# EAGLE design motherboard (EAGLE 7.6.0)
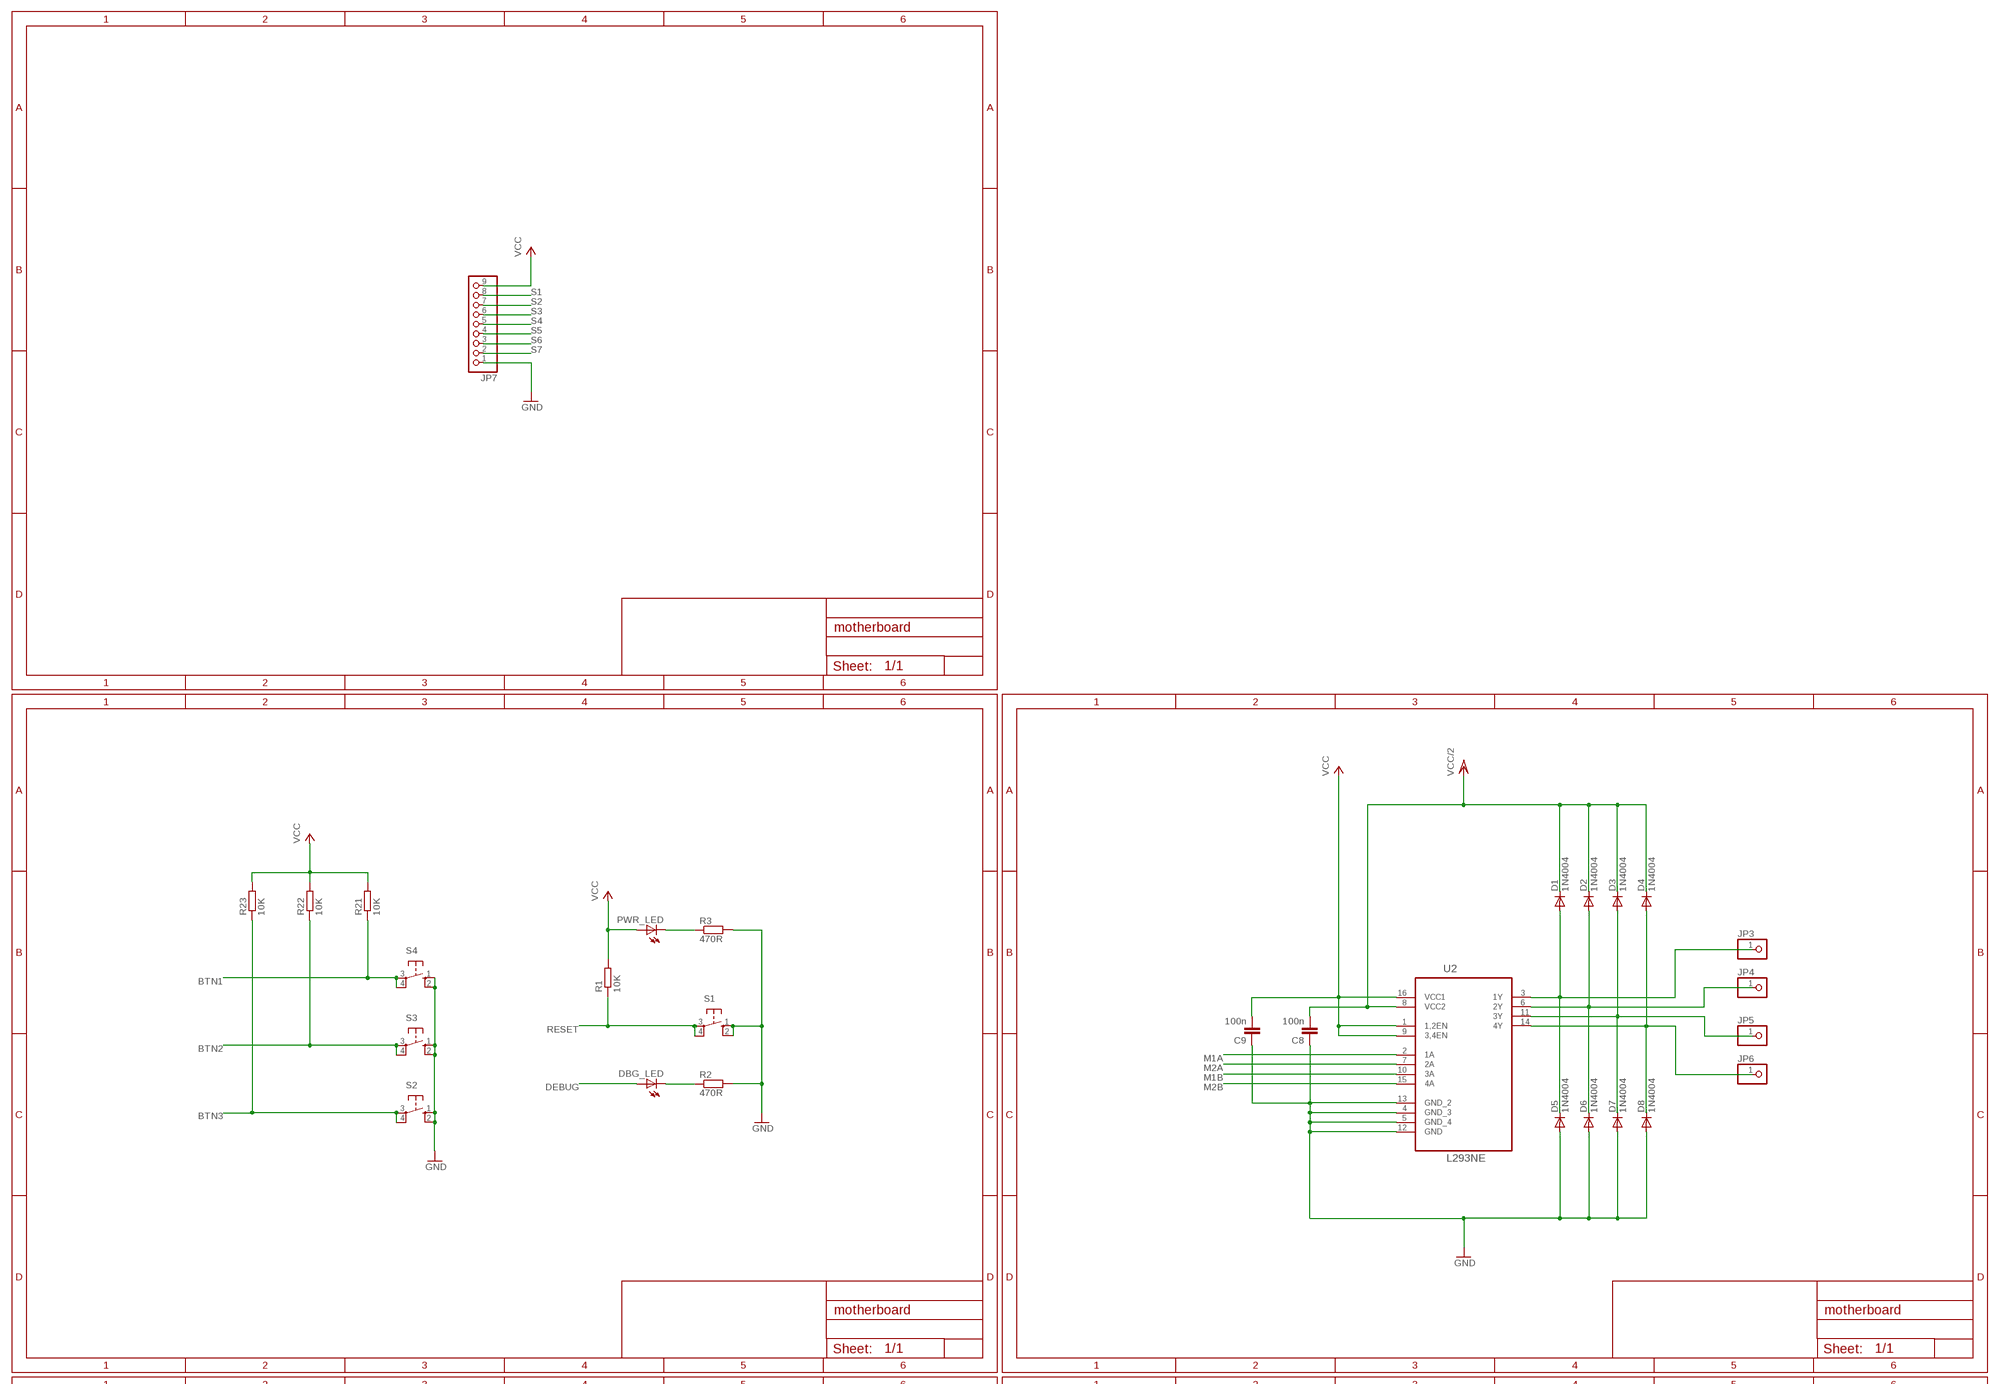
[diagram p0: schematic, sheet 1, part 1 of 2]
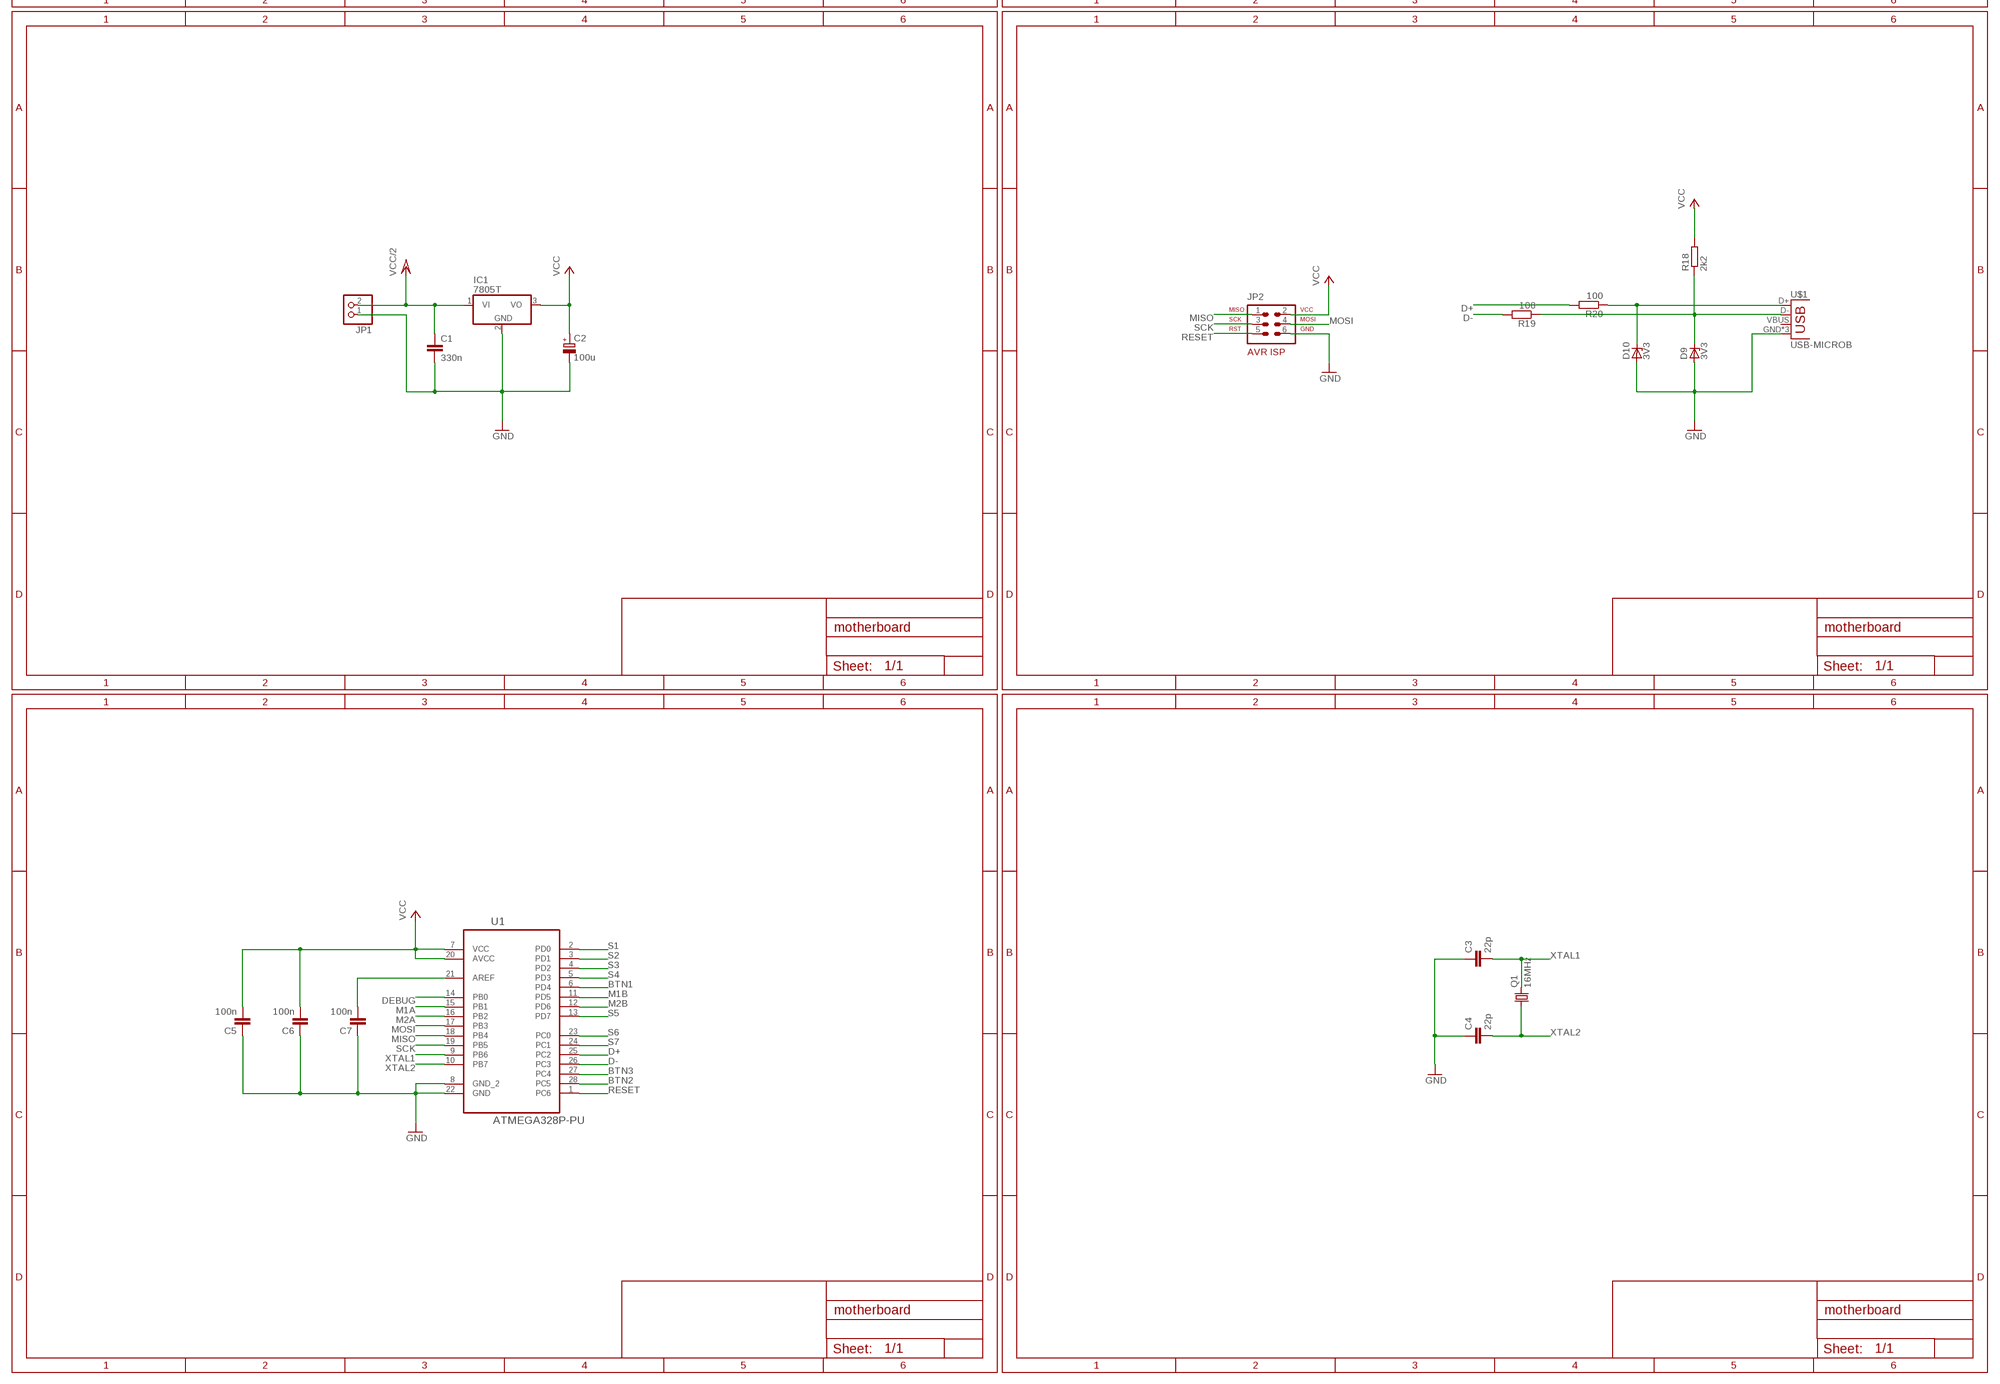
[diagram p1: schematic, sheet 1, part 2 of 2]

## Parts
C1  330n  C-EUC0805K  [C0805K]
C2  100u  CPOL-EUE2.5-5  [E2,5-5]
C3  22p  C-EUC0805K  [C0805K]
C4  22p  C-EUC0805K  [C0805K]
C5  100n  C-EUC0805K  [C0805K]
C6  100n  C-EUC0805K  [C0805K]
C7  100n  C-EUC0805K  [C0805K]
C8  100n  C-EUC0805K  [C0805K]
C9  100n  C-EUC0805K  [C0805K]
D1  1N4004  [DO41-10]
D2  1N4004  [DO41-10]
D3  1N4004  [DO41-10]
D4  1N4004  [DO41-10]
D5  1N4004  [DO41-10]
D6  1N4004  [DO41-10]
D7  1N4004  [DO41-10]
D8  1N4004  [DO41-10]
D9  3V3  ZENER-DIODEDO41Z10  [DO41Z10]
D10  3V3  ZENER-DIODEDO41Z10  [DO41Z10]
DBG_LED  LED5MM  [LED5MM]
IC1  7805T  [TO220H]
JP1  PINHD-1X2  [1X02]
JP2  AVR-ISP-6VERT  [AVR-ISP-6]
JP3  PINHD-1X1  [1X01]
JP4  PINHD-1X1  [1X01]
JP5  PINHD-1X1  [1X01]
JP6  PINHD-1X1  [1X01]
JP7  PINHD-1X9  [1X09]
PWR_LED  LED5MM  [LED5MM]
Q1  16MHz  CRYSTALHC49S  [HC49/S]
R1  10K  R-EU_M0805  [M0805]
R2  470R  R-EU_M0805  [M0805]
R3  470R  R-EU_M0805  [M0805]
R18  2k2  R-EU_M0805  [M0805]
R19  100  R-EU_M0805  [M0805]
R20  100  R-EU_M0805  [M0805]
R21  10K  R-EU_M0805  [M0805]
R22  10K  R-EU_M0805  [M0805]
R23  10K  R-EU_M0805  [M0805]
S1  10-XX  [B3F-10XX]
S2  10-XX  [B3F-10XX]
S3  10-XX  [B3F-10XX]
S4  10-XX  [B3F-10XX]
U1  ATMEGA328P-PU  [DIP254P762X457-28]
U2  L293NE  [DIP254P762X508-16]
U$1  USB-MICROB  [USB-MICROB]

## Nets
BTN1: R21.1 S4.3(P) S4.4(P1) U1.6(PD4)
BTN2: R22.1 S3.3(P) S3.4(P1) U1.28(PC5)
BTN3: R23.1 S2.3(P) S2.4(P1) U1.27(PC4)
D+: R20.2 U1.25(PC2)
D-: R19.2 U1.26(PC3)
DEBUG: DBG_LED.A U1.14(PB0)
GND: C1.2 C2.- C3.1 C4.1 C5.1 C6.1 C7.1 C8.1 C9.1 D5.A D6.A D7.A D8.A D9.A D10.A IC1.2(GND) JP1.1 JP2.6 JP7.1 R2.2 R3.2 S1.1(S) S1.2(S1) S2.1(S) S2.2(S1) S3.1(S) S3.2(S1) S4.1(S) S4.2(S1) U1.8(GND_2) U1.22(GND) U2.4(GND_3) U2.5(GND_4) U2.12(GND) U2.13(GND_2) U$1.GND U$1.MT1(GND) U$1.MT2(GND)
M1A: U1.15(PB1) U2.2(1A)
M1B: U1.11(PD5) U2.10(3A)
M2A: U1.16(PB2) U2.7(2A)
M2B: U1.12(PD6) U2.15(4A)
MISO: JP2.1 U1.18(PB4)
MOSI: JP2.4 U1.17(PB3)
N$1: PWR_LED.K(C) R3.1
N$2: DBG_LED.K(C) R2.1
N$3: C7.2 U1.21(AREF)
N$4: D1.A D5.C JP3.1 U2.3(1Y)
N$5: D2.A D6.C JP4.1 U2.6(2Y)
N$6: D3.A D7.C JP5.1 U2.11(3Y)
N$7: D4.A D8.C JP6.1 U2.14(4Y)
N$16: D9.C R18.1 R19.1 U$1.D-
N$19: D10.C R20.1 U$1.D+
RESET: JP2.5 R1.1 S1.3(P) S1.4(P1) U1.1(PC6)
S1: JP7.8 U1.2(PD0)
S2: JP7.7 U1.3(PD1)
S3: JP7.6 U1.4(PD2)
S4: JP7.5 U1.5(PD3)
S5: JP7.4 U1.13(PD7)
S6: JP7.3 U1.23(PC0)
S7: JP7.2 U1.24(PC1)
SCK: JP2.3 U1.19(PB5)
VCC: C2.+ C5.2 C6.2 C9.2 IC1.3(VO) JP2.2 JP7.9 PWR_LED.A R1.2 R18.2 R21.2 R22.2 R23.2 U1.7(VCC) U1.20(AVCC) U2.1(1,2EN) U2.9(3,4EN) U2.16(VCC1)
VCC/2: C1.1 C8.2 D1.C D2.C D3.C D4.C IC1.1(VI) JP1.2 U2.8(VCC2)
XTAL1: C3.2 Q1.2 U1.9(PB6)
XTAL2: C4.2 Q1.1 U1.10(PB7)
Unconnected: U$1.VBUS

## Library data of the parts
C1 C3-C9 = resistor:C-EU: CAPACITOR, European symbol
C2 = resistor:CPOL-EU: POLARIZED CAPACITOR, European symbol
D1-D8 = diode:1N4004: DIODE general purpose rectifier, 1 A
D9 D10 = diode:ZENER-DIODE: Z-Diode
DBG_LED PWR_LED = led:LED: LED OSRAM: - CHIPLED LG R971, LG N971, LY N971, LG Q971, LY Q971, LO R971, LY R971 LH N974, LH R974 LS Q976, LO Q976, LY Q976 LO Q996 - Hyper CHIPLED LW Q18S LB Q993, LB Q99A, LB R99A - SideLED LS A670, LO A670, LY A670, LG A670, LP A670 LB A673, LV A673, LT A673, LW A673 LH A674 LY A675 LS A676, LA A676, LO A676, LY A676, LW A676 LS A679, LY A679, LG A679 - Hyper Micro SIDELED® LS Y876, LA Y876, LO Y876, LY Y876 LT Y87S - SmartLED LW L88C, LW L88S LB L89C, LB L89S, LG L890 LS L89K, LO L89K, LY L89K LS L896, LA L896, LO L896, LY L896 - TOPLED LS T670, LO T670, LY T670, LG T670, LP T670 LSG T670, LSP T670, LSY T670, LOP T670, LYG T670 LG T671, LOG T671, LSG T671 LB T673, LV T673, LT T673, LW T673 LH T674 LS T676, LA T676, LO T676, LY T676, LB T676, LH T676, LSB T676, LW T676 LB T67C, LV T67C, LT T67C, LS T67K, LO T67K, LY T67K, LW E67C LS E67B, LA E67B, LO E67B, LY E67B, LB E67C, LV E67C, LT E67C LW T67C LS T679, LY T679, LG T679 LS T770, LO T770, LY T770, LG T770, LP T770 LB T773, LV T773, LT T773, LW T773 LH T774 LS E675, LA E675, LY E675, LS T675 LS T776, LA T776, LO T776, LY T776, LB T776 LHGB T686 LT T68C, LB T68C - Hyper Mini TOPLED® LB M676 - Mini TOPLED Santana® LG M470 LS M47K, LO M47K, LY M47K Source: http://www.osram.convergy.de LUXEON: - LUMILED® LXK2-PW12-R00, LXK2-PW12-S00, LXK2-PW14-U00, LXK2-PW14-V00 LXK2-PM12-R00, LXK2-PM12-S00, LXK2-PM14-U00 LXK2-PE12-Q00, LXK2-PE12-R00, LXK2-PE12-S00, LXK2-PE14-T00, LXK2-PE14-U00 LXK2-PB12-K00, LXK2-PB12-L00, LXK2-PB12-M00, LXK2-PB14-N00, LXK2-PB14-P00, LXK2-PB14-Q00 LXK2-PR12-L00, LXK2-PR12-M00, LXK2-PR14-Q00, LXK2-PR14-R00 LXK2-PD12-Q00, LXK2-PD12-R00, LXK2-PD12-S00 LXK2-PH12-R00, LXK2-PH12-S00 LXK2-PL12-P00, LXK2-PL12-Q00, LXK2-PL12-R00 Source: www.luxeon.com KINGBRIGHT: KA-3528ASYC Source: www.kingbright.com
IC1 = linear:78*: Positive VOLTAGE REGULATOR Source: http://cache.national.com/ds/LM/LM78L05.pdf http://www.fairchildsemi.com/ds/LM/LM7805.pdf
JP1 = pinhead:PINHD-1X2: PIN HEADER
JP2 = avr-7:AVR-ISP-6: AVR ISP-6 Serial Programming Header
JP3-JP6 = pinhead:PINHD-1X1: PIN HEADER
JP7 = pinhead:PINHD-1X9: PIN HEADER
Q1 = crystal:CRYSTAL: CRYSTAL; OC_FARNELL: 1667008; OC_NEWARK: unknown
R1-R3 R18-R23 = resistor:R-EU_: RESISTOR, European symbol
S1-S4 = switch-omron:10-XX: OMRON SWITCH; MPN: B3F-1000; OC_FARNELL: 176432; OC_NEWARK: 36M3542
U1 = untitled:ATMEGA328P-PU: 8-bit Microcontroller with In-System Programmable Flash; MPN: ATMEGA328P-PU; OC_FARNELL: 1715487; OC_NEWARK: 15R0268; PACKAGE: PDIP-28; SUPPLIER: Atmel
U2 = untitled:L293NE: QUADRUPLE HALF-H DRIVERS; MPN: L293NE; OC_FARNELL: -; OC_NEWARK: 06F9524; PACKAGE: PDIP-16; SUPPLIER: Texas Instruments
U$1 = SparkFun-Connectors:USB: USB Connectors USB-B-PTH is fully proven SKU : PRT-00139/CONN-08278 USB-miniB is fully proven SKU : PRT-00587 USB-A-PCB is untested. USB-A-H is throughly reviewed, but untested. Spark Fun Electronics SKU : PRT-00437 USB-B-SMT is throughly reviewed, but untested. Needs silkscreen touching up. USB-A-S has not been used/tested USB-MB-H has not been used/tested USB-MICROB has been used. CONN-09505; PROD_ID: CONN-09505

## Board
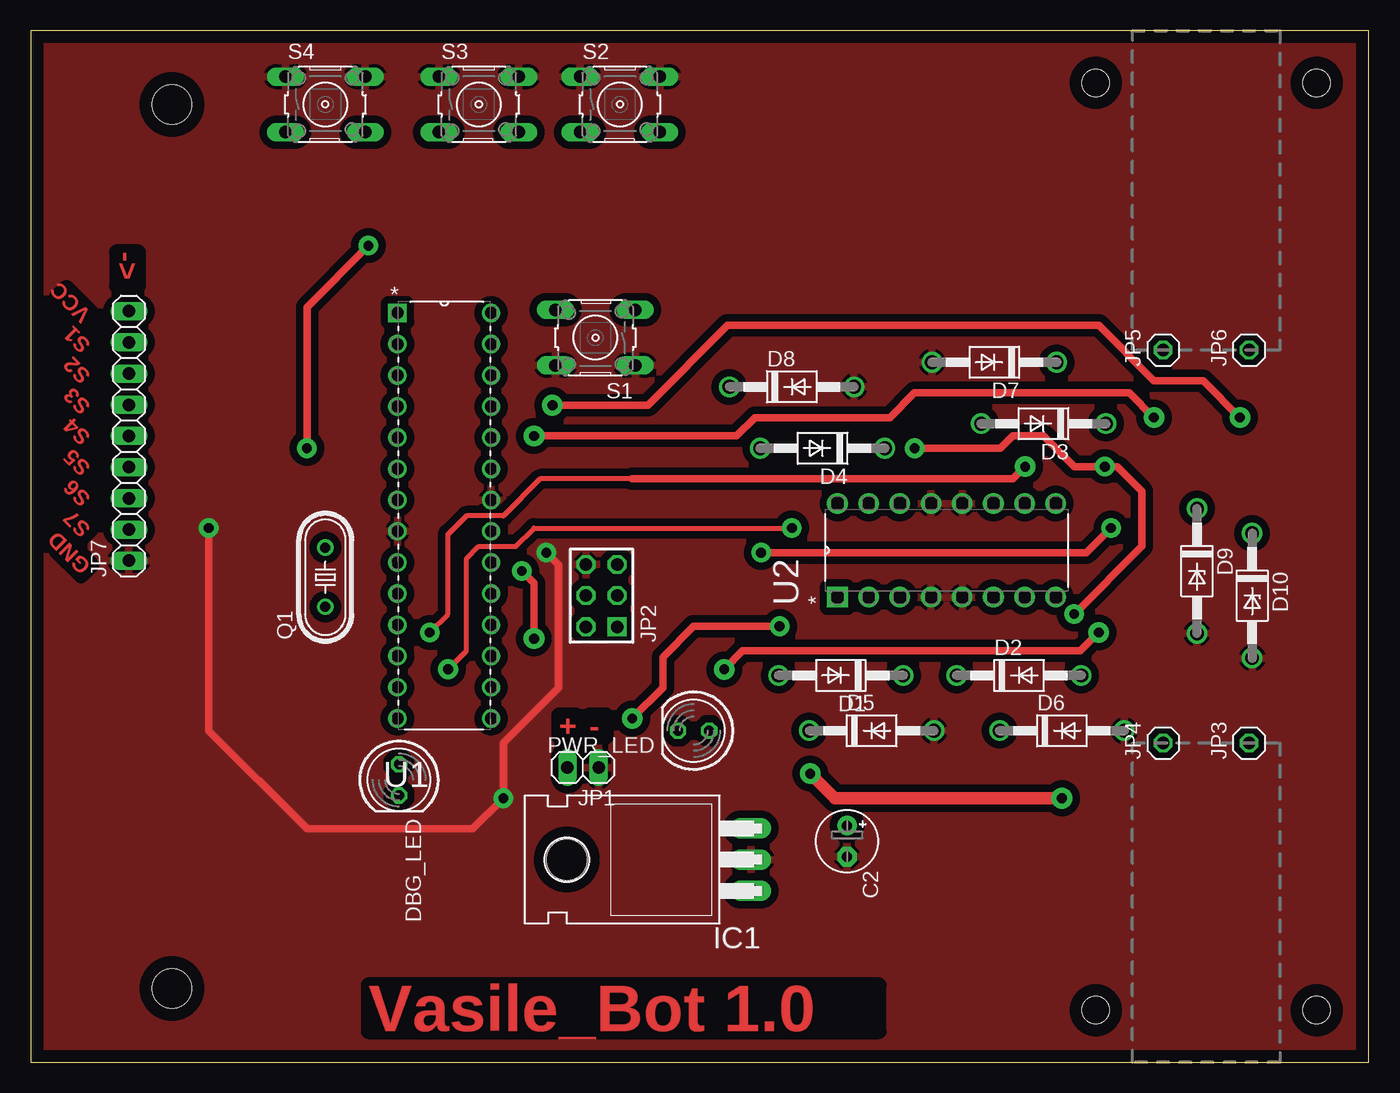
[diagram p2: board, top side]
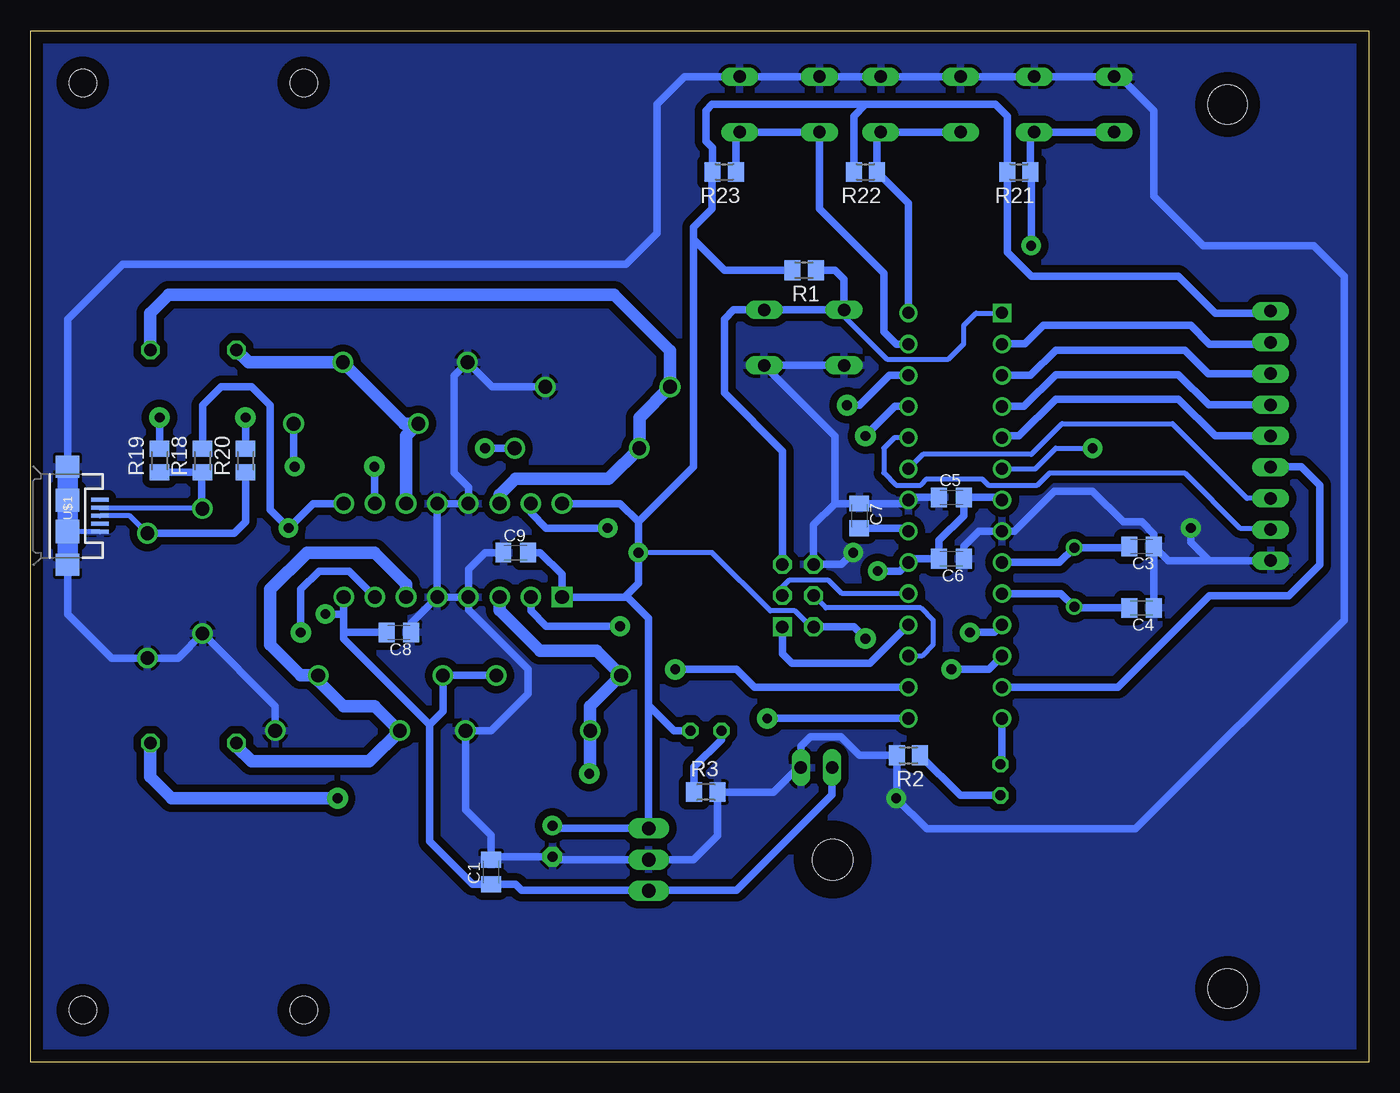
[diagram p3: board, bottom side, seen from below]

Size 109 x 84 mm. Coordinates in mm from the lower left corner, seen from the top.
Outline: 0,0 109,0 109,84 0,84 0,0
Copper layers (1*16): Top 0.035mm / dielectric 1.5mm / Bottom 0.035mm
Design rules "default *": minimum track width 10mil, minimum drill 24mil, track to track 8mil, track to pad 8mil, pad to pad 8mil, via to via 8mil, smd to smd 8mil, copper to edge 40mil, drill to drill 8mil, minimum pad ring 10mil, minimum via ring 8mil, stop-mask expansion 4mil, vias tented up to drill 0mil, thermal gap 10mil
Holes 3.2 mm at 11.5,6 11.5,78
Holes 2.2 mm at 86.75,79.75 104.75,79.75 104.75,4.25 86.75,4.25

### Footprints (pad centres in the part's own frame; a part is rotated, then mirrored left to right if it is on the bottom)
C0805K = smd 1.3 x 1.6: 1 -1,0; 2 1,0
E2,5-5 = drill 0.813 pad 1.6: + -1.27,0 | drill 0.813 pad 1.6 octagon: - 1.27,0
DO41-10 = drill 1.118: A 5.08,0; C -5.08,0
DO41Z10 = drill 1.118: A 5.08,0; C -5.08,0
LED5MM = drill 0.813 octagon: A -1.27,0; K 1.27,0
TO220H = drill 1.118 long: 1 -2.54,-10.16; 2 0,-10.16; 3 2.54,-10.16 | hole 3.302: 0,4.826
1X02 = drill 1.016 long: 1 -1.27,0; 2 1.27,0
AVR-ISP-6 = drill 1.016 square: 1 -2.54,-1.27 | drill 1.016 octagon: 2 -2.54,1.27; 3 0,-1.27; 4 0,1.27; 5 2.54,-1.27; 6 2.54,1.27
1X01 = drill 1.016 octagon: 1 0,0
1X09 = drill 1.016 long: 1 -10.16,0; 2 -7.62,0; 3 -5.08,0; 4 -2.54,0; 5 0,0; 6 2.54,0; 7 5.08,0; 8 7.62,0; 9 10.16,0
HC49/S = drill 0.813: 1 -2.413,0; 2 2.413,0
M0805 = smd 1.3 x 1.6: 1 -0.95,0; 2 0.95,0
B3F-10XX = drill 1.016 long: 1 -3.251,2.261; 2 3.251,2.261; 3 -3.251,-2.261; 4 3.251,-2.261
DIP254P762X457-28 = drill 0.991 square: 1 -7.62,33.02 | drill 0.991: 2 -7.62,30.48; 3 -7.62,27.94; 4 -7.62,25.4; 5 -7.62,22.86; 6 -7.62,20.32; 7 -7.62,17.78; 8 -7.62,15.24; 9 -7.62,12.7; 10 -7.62,10.16; 11 -7.62,7.62; 12 -7.62,5.08; 13 -7.62,2.54; 14 -7.62,0; 15 0,0; 16 0,2.54; 17 0,5.08; 18 0,7.62; 19 0,10.16; 20 0,12.7; 21 0,15.24; 22 0,17.78; 23 0,20.32; 24 0,22.86; 25 0,25.4; 26 0,27.94; 27 0,30.48; 28 0,33.02
DIP254P762X508-16 = drill 1.118 square: 1 -7.62,17.78 | drill 1.118: 2 -7.62,15.24; 3 -7.62,12.7; 4 -7.62,10.16; 5 -7.62,7.62; 6 -7.62,5.08; 7 -7.62,2.54; 8 -7.62,0; 9 0,0; 10 0,2.54; 11 0,5.08; 12 0,7.62; 13 0,10.16; 14 0,12.7; 15 0,15.24; 16 0,17.78
USB-MICROB = smd 0.35 x 1.4: D+ 0,2.65; D- -0.65,2.65; GND 1.3,2.65; ID 0.65,2.65; VBUS -1.3,2.65 | smd 1.8 x 1.9: MT1 -4,0; MT2 4,0 | smd 1.9 x 1.9: P$1 -1.27,0; P$2 1.27,0

### Placement (x,y rotation side)
C1  71.5,15.5 90 bottom
C2  66.5,18 270 top
C3  18.5,42 180 bottom
C4  18.5,37 180 bottom
C5  34,46 0 bottom
C6  34,41 180 bottom
C7  41.5,44.5 270 bottom
C8  79,35 180 bottom
C9  69.5,41.5 0 bottom
D1  66,31.5 180 top
D2  80.5,31.5 0 top
D3  82.5,52 180 top
D4  64.5,50 180 top
D5  68.5,27 0 top
D6  84,27 0 top
D7  78.5,57 180 top
D8  62,55 0 top
D9  95,40 270 top
D10  99.5,38 270 top
DBG_LED  30,23 270 top
IC1  48.5,16.5 90 top
JP1  45,24 180 top
JP2  46.5,38 90 top
JP3  99.25,26 90 top
JP4  92.25,26 90 top
JP5  92.25,58 90 top
JP6  99.25,58 90 top
JP7  8,51 90 top
PWR_LED  54,27 180 top
Q1  24,39.5 90 top
R1  46,64.5 180 bottom
R2  37.5,25 180 bottom
R3  54,22 0 bottom
R18  95,49 90 bottom
R19  98.5,49 90 bottom
R20  91.5,49 90 bottom
R21  28.5,72.5 180 bottom
R22  41,72.5 180 bottom
R23  52.5,72.5 180 bottom
S1  46,59 180 top
S2  48,78 0 top
S3  36.5,78 0 top
S4  24,78 0 top
U1  37.5,28 0 top
U2  83.5,45.5 90 top
U$1  106,44.5 270 bottom

### Tracks (layer width: path | path; a pad name or v marks a point on that pad's centre or on a via)
BTN1  (via drill 0.8 pad 1.6)
  Top 0.61: v22.5,50 22.5,61.5 v27.5,66.5
  Bottom 0.406: U1.6 27.18,48.32 25.5,50 v22.5,50
  Bottom 0.61: S4.3 S4.4 27.55,75.44 R21.1 27.5,72.45 v27.5,66.5
BTN2
  Bottom 0.61: S3.3 S3.4 40.05,75.44 R22.1 37.5,69.95 U1.28
BTN3
  Bottom 0.61: S2.3 44.55,75.74 | S2.3 S2.4 51.55,75.44 R23.1 | U1.27 38.48,58.48 39.5,59.5 39.5,64.25 44.75,69.5 S2.3
D+  (via drill 0.8 pad 1.68)
  Top 0.61: v91.5,52.5 89.5,54.5 72,54.5 70,52.5 59,52.5 57.5,51 v41,51
  Bottom 0.61: R20.2 v91.5,52.5 | v41,51 38.6,53.4 U1.25
D-  (via drill 0.8 pad 1.68)
  Top 0.61: v42.5,53.5 50.27,53.5 56.77,60 87,60 91.5,55.5 95.5,55.5 v98.5,52.5
  Bottom 0.61: R19.2 v98.5,52.5 | v42.5,53.5 41.5,53.5 39.06,55.94 U1.26
DEBUG
  Bottom 0.61: U1.14 29.88,24.39 DBG_LED.A
GND  (via drill 0.8 pad 1.6)
  Top 0.61: v42,41.5 43,40.5 43,30.5 38.5,26 v38.5,21.5 36,19 22.5,19 14.5,27 v14.5,43.5
  Bottom 0.41: U$1.GND 105.8,43.2 106,43
  Bottom 0.61: S1.2 S1.1 43.5,50.99 43.5,45.5 | U2.4 U2.5 | C3.1 C4.1 | U$1.MT2 106,36.5 102.42,32.92 D10.A 97,32.92 D9.A 89.08,29 D6.A | 71.23,16.73 C2.- 66.27,16.5 IC1.2 55,16.5 53.05,18.45 R3.2 48.5,22 46.5,24 JP1.1 46.27,25.73 45.5,26.5 43,26.5 41.5,25 R2.2 38.45,21.55 v38.5,21.5 36,19 19,19 2,36 2,64 4.5,66.5 13.5,66.5 17.5,70.5 17.5,77.5 20.26,80.26 S4.1 S4.2 S3.1 S3.2 S2.1 S2.2 55.74,80.26 58,78 58,67.5 60.5,65 101.5,65 106,60.5 U$1.MT1 | 43.5,45.5 45.23,43.77 JP2.6 42.96,40.54 v42,41.5 | 43.5,45.5 C7.1 37.78,45.5 U1.22 37.28,46 C5.1 | U2.5 U2.12 U2.13 73.34,46.84 74.5,48 74.5,55.92 D7.A 71.42,55 D8.A | C3.1 17.5,43 18.5,44 20,44 22.5,46.5 25.62,46.5 28.88,43.24 U1.8 31.76,43.24 33,42 C6.1 | JP7.1 13,40.84 | 13,40.84 16.34,40.84 C3.1 | 13,40.84 14.5,42.34 v14.5,43.5 | C8.1 78,35.76 U2.5 | U2.4 73.34,40.16 72,41.5 C9.1 | U2.4 73.34,36.84 68.5,32 68.5,30 71.5,27 D5.A 73.58,20.58 71.5,18.5 C1.2
  Bottom 1.674: U$1.MT1 106,43 U$1.MT2
  pour Top (isolate 0.61): 0,0 0,84 109,84 109,0
  pour Bottom (isolate 0.61): 0,0 0,84 109,84 109,0
M1A  (via drill 0.8 pad 1.6, 0.8 pad 1.68)
  Top 0.61: v61,35.5 54,35.5 51.5,33 51.5,30.5 v49,28
  Bottom 0.61: U1.15 v49,28 | v61,35.5 67,35.5 68.26,36.76 U2.2
M1B  (via drill 0.8 pad 1.6, 0.8 pad 1.68)
  Top 0.406: 49,47.5 41.5,47.5 38.5,44.5 35.5,44.5 34,43 34,36.5 v32.5,35
  Top 0.61: 49,47.5 80,47.5 v81,48.5
  Bottom 0.61: U2.10 81,45.54 v81,48.5 | U1.11 30.5,35 v32.5,35
M2A  (via drill 0.8 pad 1.68)
  Top 0.61: v56.5,32 58,33.5 85.5,33.5 v87,35
  Bottom 0.61: U2.7 83.08,40 85.5,40 87,38.5 v87,35 | U1.16 50.04,30.54 51.5,32 v56.5,32
M2B  (via drill 0.8 pad 1.6)
  Top 0.406: v62,43.5 41,43.5 39.5,42 36.5,42 35.5,41 35.5,33.5 v34,32
  Bottom 0.61: U2.15 68.26,44.76 67,43.5 v62,43.5 | U1.12 30.96,32 v34,32
MISO
  Bottom 0.61: JP2.1 47.77,33.27 47,32.5 40.62,32.5 U1.18
MOSI
  Bottom 0.406: U1.17 36.42,33.08 35.5,34 35.5,36 36.5,37 44.23,37 JP2.4
N$1
  Bottom 0.61: R3.1 54.95,24.05 52.73,26.27 PWR_LED.K
N$2
  Bottom 0.61: DBG_LED.K 33.28,21.73 R2.1
N$3
  Bottom 0.61: U1.21 37.76,43.5 C7.2
N$4  (via drill 0.8 pad 1.68)
  Top 1.016: v84,21.5 65.5,21.5 v63.5,23.5
  Bottom 0.61: v63.5,23.5 63.42,23.58
  Bottom 1.016: 63.42,23.58 D5.C 63.42,29 D1.A 62.92,33.5 67.5,33.5 70.8,36.8 U2.3 | v84,21.5 97.5,21.5 99.25,23.25 99.25,24.75 99.25,25.5 JP3.1
N$5
  Bottom 0.61: D6.C 79,27 | 85.58,31.08 D2.A
  Bottom 1.016: 79,27 81,29 83.5,29 85.58,31.08 | D2.A 87,31.5 89.5,34 89.5,38.5 86.5,41.5 81,41.5 78.42,38.92 U2.6 | D6.C 81.42,24.5 91,24.5 92.25,25.75 JP4.1
N$6
  Bottom 1.016: U2.11 78.42,51 D3.A 78.58,52 D7.C 91.25,57 JP5.1
N$7
  Bottom 1.016: U2.14 70.8,46.2 69.5,47.5 61.92,47.5 D4.A 59.42,52.5 D8.C 56.92,57.92 61.5,62.5 97.75,62.5 99.25,61 JP6.1
N$16
  Bottom 0.406: U$1.D- 95.07,45.15 D9.C
  Bottom 0.61: R19.1 R18.1 95.07,47.98 95.07,45.15
N$19
  Bottom 0.406: D10.C 100.92,44.5 U$1.D+
  Bottom 0.61: D10.C 92.42,43.08 91.5,44 R20.1
RESET
  Bottom 0.406: S1.4 42.75,60.75 39.25,57.25 34.25,57.25 33,58.5 33,60 32,61 29.9,61 U1.1
  Bottom 0.61: JP2.5 47.77,49.77 52.5,54.5 52.5,60.5 51.74,61.26 S1.3 S1.4 42.75,63.75 43.5,64.5 R1.1
S1
  Bottom 0.406: JP7.8 8.14,58.48
  Bottom 0.61: 8.14,58.48 12.98,58.48 14.5,60 26.5,60 28,58.5 29.86,58.5 U1.2
S2
  Bottom 0.61: JP7.7 13.08,56.08 15,58 25.5,58 27.56,55.94 U1.3
S3
  Bottom 0.61: JP7.6 13.04,53.54 15.5,56 25.5,56 28.1,53.4 U1.4
S4
  Bottom 0.61: JP7.5 12.5,51 15.5,54 25.5,54 28.5,51 29.74,51 U1.5
S5
  Bottom 0.406: 7.96,48.5 JP7.4
  Bottom 0.61: 7.96,48.5 5.5,48.5 4,47 4,40.5 6.5,38 13,38 20.46,30.54 U1.13
S6
  Bottom 0.406: JP7.3 9.92,45.92 16,52 25,52 27.5,49.5 36.32,49.5 U1.23
S7
  Bottom 0.406: U1.24 38.64,50.86 39.5,50 39.5,48 38.5,47 36.5,47 36,47.5 31.5,47.5 31,47 27,47 26,48 15,48 10.5,43.5 8.12,43.5 JP7.2
SCK
  Bottom 0.406: U1.19 42.91,38.16 44,39.25 47.25,39.25 47.77,38.73 JP2.3
VCC  (via drill 0.8 pad 1.6, 0.8 pad 1.68)
  Top 0.61: v88,43.5 86,41.5 v59.5,41.5 | v40,40 41,39 v41,34.5
  Bottom 0.406: JP2.2 45.46,35.46 46.75,36.75 48.75,36.75 53.5,41.5 v59.5,41.5
  Bottom 0.61: C2.+ 66.27,19.04 IC1.3 58.66,29.08 | U1.7 30.1,46 C5.2 33,44.5 35,42.5 C6.2 37.2,41 U1.20 38.2,40 v40,40 | R18.2 95,53.5 93.5,55 91,55 89.5,53.5 89.5,45 v88,43.5 86,45.5 U2.9 | PWR_LED.A 56.58,27 58.66,29.08 | 41,78 53.5,78 54,77.5 54,75 53.45,74.45 R23.2 53.5,72.45 53.5,69.5 55,68 55,67 | R22.2 41.95,77.05 41,78 | 59.5,44 55,48.5 55,67 | R1.2 52.5,64.5 55,67 | JP7.9 8.16,61 12.5,61 15.5,64 27.5,64 29.45,65.95 R21.2 29.45,77.05 30.4,78 41,78 | 45.19,35.5 JP2.2 41.96,35.46 v41,34.5 | 60.5,38 60.62,37.88 U2.1 65.72,39.72 67.5,41.5 C9.2 | 60.5,38 59.5,39 v59.5,41.5 59.5,44 | U2.16 61,45.5 59.5,44 | 58.66,29.08 58.66,36.16 60.5,38
VCC/2  (via drill 0.8 pad 1.6)
  Top 0.61: v72,50 79,50 80,51 82.5,51 85,48.5 v87.5,48.5 88.5,48.5 90.5,46.5 90.5,42 v85,36.5
  Bottom 0.61: 76.5,27.5 76.5,18 73,14.5 C1.1 69.5,14.5 69,14 58.7,14 IC1.1 58.62,14 51.5,14 43.73,21.77 JP1.2 | 76.5,27.5 83.5,34.5 83.5,35 | 83.5,35 83.5,36.5 | 83.5,36.5 U2.8 | C8.2 83.5,35 | D1.C D2.C 75.42,28.58 76.5,27.5 | D4.C v72,50 | v87.5,48.5 87.58,48.58 D3.C | v85,36.5 83.5,36.5
XTAL1
  Bottom 0.61: U1.9 25.21,40.7 Q1.2 19.59,41.91 C3.2
XTAL2
  Bottom 0.61: U1.10 25.07,38.16 Q1.1 23.91,37 C4.2

### Text on the board
Top: -> | VCC | S1 | S2 | S3 | S4 | S5 | S6 | S7 | GND | + | - | Vasile_Bot 1.0